# Altium project tinyCurrent_Version1.PrjPcb
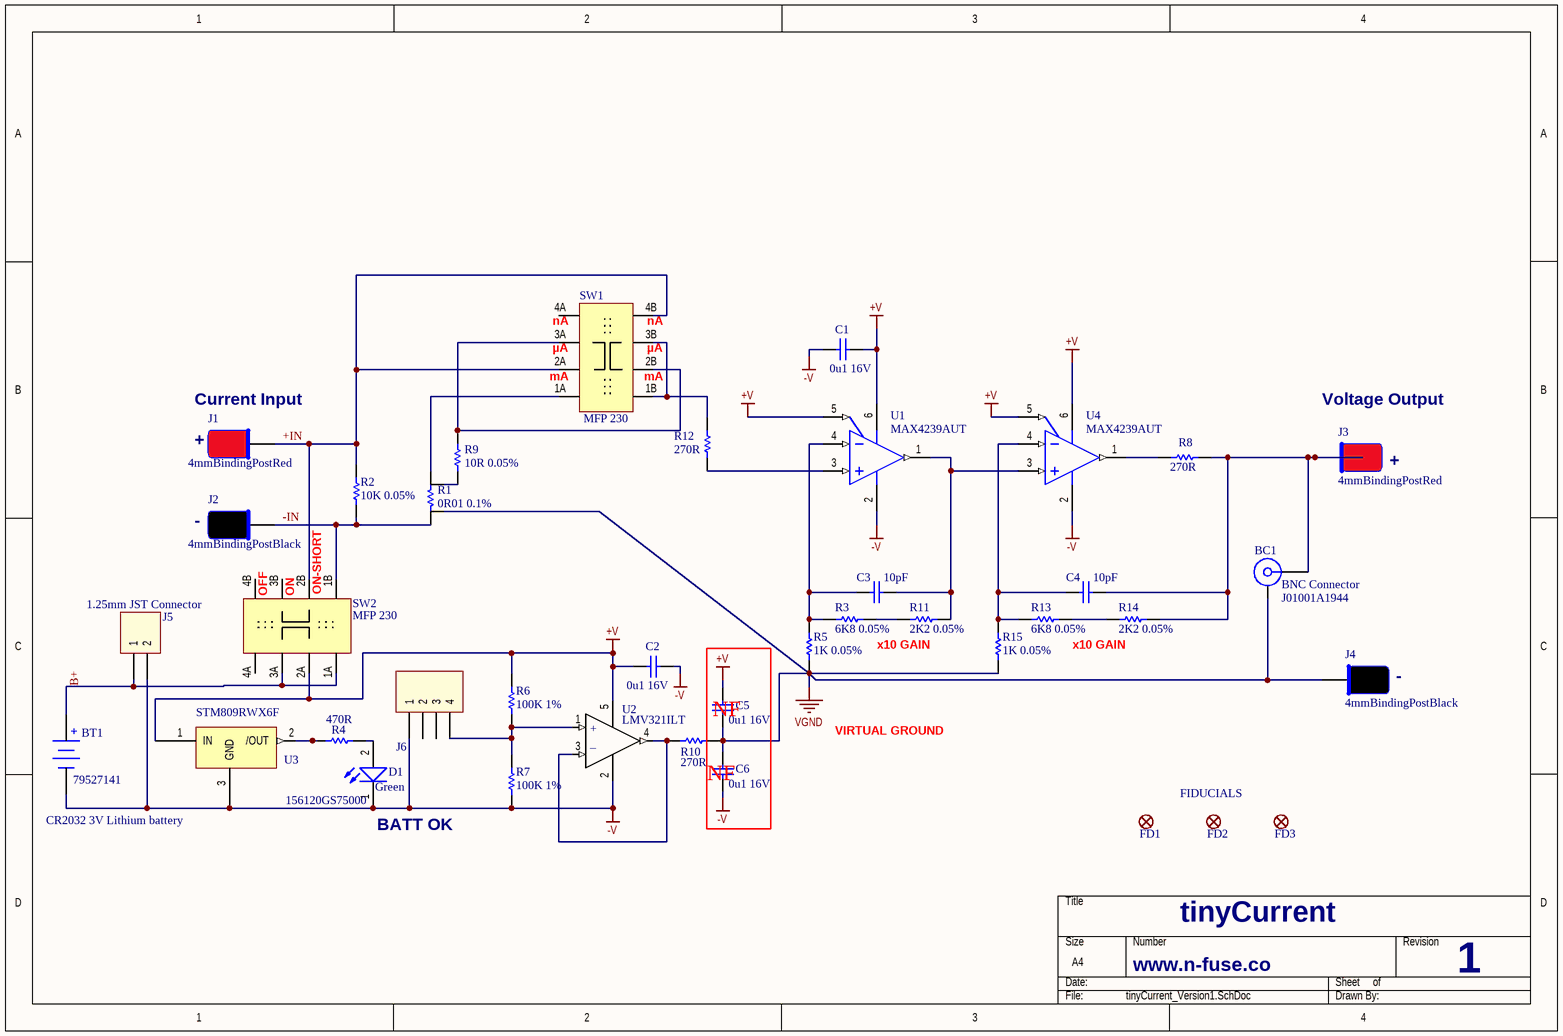
[diagram p0: tinyCurrent_Version1.SchDoc]
1 sheet, 39 parts. Net scope: global (net labels, ports and power ports of the same name join across sheets).
Board file: tinyCurrent_Version1.PcbDoc

## Sheet tinyCurrent_Version1.SchDoc
size A4; DrawnBy: Thomas Hoppe

### Parts
BC1  J01001A1944  [ROS-51K101-400A4_V]
BT1  79527141  [79527141]
C1  0u1 16V  [WCAP-CSGP_0603, 1.6x0.8x0.8]
C2  0u1 16V  [WCAP-CSGP_0603, 1.6x0.8x0.8]
C3  10pF  [WCAP-CSGP_0603, 1.6x0.8x0.8]
C4  10pF  [WCAP-CSGP_0603, 1.6x0.8x0.8]
C5  0u1 16V  [WCAP-CSGP_0603, 1.6x0.8x0.8]
C6  0u1 16V  [WCAP-CSGP_0603, 1.6x0.8x0.8]
D1  156120GS75000  EmittingColor: Green  [WL-SMRW_1206 rectangular_Normal use]
FD1  FIDUCIAL1X2  [FIDUCIAL-1X2]  (value not drawn)  (no BOM)
FD2  FIDUCIAL1X2  [FIDUCIAL-1X2]  (value not drawn)  (no BOM)
FD3  FIDUCIAL1X2  [FIDUCIAL-1X2]  (value not drawn)  (no BOM)
J1  4mmBindingPostRed  [4mmBindingPost]
J2  4mmBindingPostBlack  [4mmBindingPost]
J3  4mmBindingPostRed  [4mmBindingPost]
J4  4mmBindingPostBlack  [4mmBindingPost]
J5  1.25mm JST Connector  [653102131822]
J6  61000413321  [61000413321]  (value not drawn)
R1  0R01 0.1%  [2512shuntresistor]
R2  10K 0.05%  [RESC1608N]
R3  6K8 0.05%  [RESC1608N]
R4  470R  [RESC1608N]
R5  1K 0.05%  [RESC1608N]
R6  100K 1%  [RESC1608N]
R7  100K 1%  [RESC1608N]
R8  270R  [RESC1608N]
R9  10R 0.05%  [RESC2012N]
R10  270R  [RESC1608N]
R11  2K2 0.05%  [RESC1608N]
R12  270R  [RESC1608N]
R13  6K8 0.05%  [RESC1608N]
R14  2K2 0.05%  [RESC1608N]
R15  1K 0.05%  [RESC1608N]
SW1  MFP 230  [MFP 230]
SW2  MFP 230  [MFP 230]
U1  MAX4239AUT  [SOT-23-CH6_N]
U2  LMV321ILT  [SOT95P280X130-5N]
U3  STM809RWX6F  [SOT23]
U4  MAX4239AUT  [SOT-23-CH6_N]

### Nets
+V: C1.2 C2.1 C5.2 R6.2 SW2.2A U1.5(~{CS}) U1.6(VDD) U2.5 U3.1(IN) U4.5(~{CS}) U4.6(VDD)
-V: BT1.2(Neg) C1.1 C2.2 C6.1 D1.1(K) J5.2 J6.1 R7.2 U1.2(VSS) U2.2 U3.3(GND) U4.2(VSS)
VGND: BC1.MH C5.1 C6.2 J4.1(NOISE) R1.4 R5.2 R10.1 R15.2
+IN: J1.1(NOISE) R2.1 SW1.2A SW1.4B SW2.2B
-IN: J2.1(NOISE) R1.2 R2.2 SW2.1B
B+: BT1.1(Pos) J5.1 SW2.1A SW2.3A
NetBC1_1: BC1.1 C4.2 J3.1(NOISE) R8.1 R14.2
NetC3_1: C3.1 R3.1 R5.1 U1.4(VIN-)
NetC3_2: C3.2 R11.2 U1.1(VOUT) U4.3(VIN+)
NetC4_1: C4.1 R13.1 R15.1 U4.4(VIN-)
NetD1_2: D1.2(A) R4.1
NetJ6_4: J6.4 R6.1 R7.1 U2.1
NetR1_1: R1.1 SW1.1A
NetR1_3: R1.3 R9.2
NetR3_2: R3.2 R11.1
NetR4_2: R4.2 U3.2(/OUT)
NetR8_2: R8.2 U4.1(VOUT)
NetR9_1: R9.1 SW1.2B SW1.3A
NetR10_2: R10.2 U2.3 U2.4
NetR12_1: R12.1 SW1.1B SW1.3B
NetR12_2: R12.2 U1.3(VIN+)
NetR13_2: R13.2 R14.1

Not connected (* = marked no-connect by the designer): J6 2 3; SW1 4A; SW2 3B 4A 4B

### Notes on the sheet
- (near SW1) mA
- (near SW1) nA
- (near SW1) µA
- (near J1) +
- (near J1) Current Input
- (near J3) Voltage Output
- (near J3) +
- (near J2) -
- (near SW2) OFF
- (near SW2) ON
- (near SW2) ON-SHORT
- x10 GAIN
- (near BC1) BNC Connector
- (near C5) NF
- (near J4) -
- (near C6) NF
- VIRTUAL GROUND
- CR2032 3V Lithium battery
- (near D1) BATT OK
- (near FD2) FIDUCIALS
- tinyCurrent
- www.n-fuse.co
- 1
- (in symbol 79527141) +
- (in symbol Component_1_1) +; _

### Library data of the parts
BC1 = 51K101-400A4: BNC 50R Straight Jack, Up to 10 GHz, -55 to 155 degC; Design Note: Footprint in library is a generic example - only application specific footprint delivers High Performance; DatasheetVersion: c00; PackageVersion: c00; PackageReference: 51K101-400A4; PackageDescription: 50R BNC Straight Jack, 12 x 12 x 15 mm; Mounting Technology: Through Hole; PartNumber: 51K101-400A4; ComponentLink1Description: Manufacturer URL; ComponentLink1URL: http://www.rosenberger.de; ComponentLink2Description: Datasheet; ComponentLink2URL: http://rosenberger.de/ok/images/documents/db/51K101-400A4.pdf; ComponentLink3Description: Package Specification; ComponentLink3URL: http://rosenberger.de/ok/images/documents/db/51K101-400A4.pdf; ComponentLink4Description: URL Link1; ComponentLink4URL: Series Overview / Design Note:http://rosenberger.de/ok/images/documents/spez/51.pdf; ComponentLink5Description: Webshop / RFQ; ComponentLink5URL: http://www.rosenberger.com/en/contact/sales/
BT1 = 79527141: Battery Holder WA-BCPH, Battery Type: 2032p; BatteryType: 2032; PublishedDate: Nov. 2016; Publisher: Wurth Elektronik; ComponentLink1Description: Manufacturer; ComponentLink1URL: http://www.we-online.de; ComponentLink2Description: Datasheet; ComponentLink2URL: http://katalog.we-online.de/em/datasheet/79527141.pdf; PartNumber: 79527141
C1 C2 C5 C6 = WCAP-CSGP, 885012206046: WCAP-CSGP Ceramic Capacitors, 0603, 100000pF; RatedVoltage: 16V DC; CeramicType: X7R; PublishedDate: Aug 2016; Publisher: Wurth Elektronik; ComponentLink1Description: Manufacturer; ComponentLink1URL: http://www.we-online.de; ComponentLink2Description: Datasheet; ComponentLink2URL: http://katalog.we-online.com/pbs/datasheet/885012206046.pdf; PartNumber: 885012206046; Value: 100000pF; Size: 0603
C3 C4 = WCAP-CSGP, 885012006051: WCAP-CSGP Ceramic Capacitors, 0603, 10pF; RatedVoltage: 50V DC; CeramicType: NP0; PublishedDate: Aug 2016; Publisher: Wurth Elektronik; ComponentLink1Description: Manufacturer; ComponentLink1URL: http://www.we-online.de; ComponentLink2Description: Datasheet; ComponentLink2URL: http://katalog.we-online.com/pbs/datasheet/885012006051.pdf; PartNumber: 885012006051; Value: 10pF; Size: 0603
D1 = 156120GS75000: WL-SMRW SMD Mono-color Reverse mount Waterclear, size 1206 rectangular, Green; ForwardVoltage: 3.3 V; ViewingAngle: 140°; PeakWavelength: 520 nm; PublishedDate: Jan. 2017; Publisher: Wurth Elektronik; ComponentLink1Description: Manufacturer; ComponentLink1URL: http://www.we-online.de; ComponentLink2Description: Datasheet; ComponentLink2URL: http://katalog.we-online.de/led/datasheet/156120GS75000.pdf; PartNumber: 156120GS75000; Size: 1206 rectangular
FD1-FD3 = FIDUCIAL1X2: Fiducial Alignment Points    Point-of-reference for pick-and-place machines and other optical instruments.
J5 = 653102131822: WR-WTB 1.25mm SMT Male Horizontal Shrouded Header, 2p; Pin Number: 2; ComponentLink1Description: Manufacturer; ComponentLink1URL: http://www.we-online.de; ComponentLink2Description: Datasheet; ComponentLink2URL: http://katalog.we-online.de/em/datasheet/6531xx131822.pdf; Part Number: 653102131822; Published Date: June 2017; Publisher: Wurth Elektronik; Pitch: 1.25 mm
J6 = 61000413321: WR-PHD 2.54 mm SMT Socket Header, 4p; Pin Number: 4; Rated Current: 3A; Working Voltage: 250V AC; Withstanding Voltage: 500V AC; Pitch: 2.54mm; ComponentLink1Description: Manufacturer; ComponentLink1URL: http://www.we-online.de; ComponentLink2Description: Datasheet; ComponentLink2URL: http://katalog.we-online.de/em/datasheet/6100xx13321.pdf; Part Number: 61000413321; Published Date: August 2017; Publisher: Wurth Elektronik
R1 = 1206currentShunt: 1206 Current Shunt
R2-R5 R8-R15 = D-100-0004: Power Rating: 125 mW; Resistance: 75 R; Tolerance: 1 %; Mounting Technology: Surface Mount; Status: Production; Category: Resistor
R6 R7 = D-100-0004: Power Rating: 125 mW; Resistance: 75 R; Mounting Technology: Surface Mount; Status: Production; Tolerance: 1 %; Category: Resistor
SW1 SW2 = MFP 230: Slide Switch
U1 U4 = MCP6273T-E/CH: 170 uA, 2 MHz Rail-to-Rail Operational Amplifier, 6-Pin SOT-23, Extended Temperature, Tape and Reel; Published: 29-Jan-2009; DatasheetVersion: revF, Mar-2008; PackageVersion: revBB, Aug-2009; PackageReference: SOT-23-CH6; Publisher: Altium Limited; PackageDescription: 6-Lead Plastic Small Outline Transistor (CH) [SOT-23]; Supplier 1: Digi-Key; Supplier Part Number 1: MCP6273T-E/CHTR-ND; Supplier 2: Digi-Key; Supplier Part Number 2: MCP6273T-E/CHCT-ND; Supplier 3: Digi-Key; Supplier Part Number 3: MCP6273T-E/CHDKR-ND; Code_IPC: SOT26A-6; ComponentLink1Description: Datasheet; ComponentLink1URL: http://ww1.microchip.com/downloads/en/DeviceDoc/21810f.pdf; ComponentLink2Description: Packaging Specification; ComponentLink2URL: http://www.microchip.com/stellent/groups/techpub_sg/documents/packagingspec/en012702.pdf; ComponentLink3Description: Microchip.com Home; ComponentLink3URL: http://www.microchip.com/
U2 = Component_1_1
U3 = VoltageSupervisor